# EasyEDA Pro project 快沿发生器.epro

# Schematic Schematic1
Assembly Variant: Basic; Board Name: Board1; Create Date: 2026-08-30; Page Name: P1; Project Name: 快沿发生器; Schematic Name: Schematic1; Update Date: 2026-08-30; Company: 嘉立创EDA; Page Size: A4; Version: V1.0
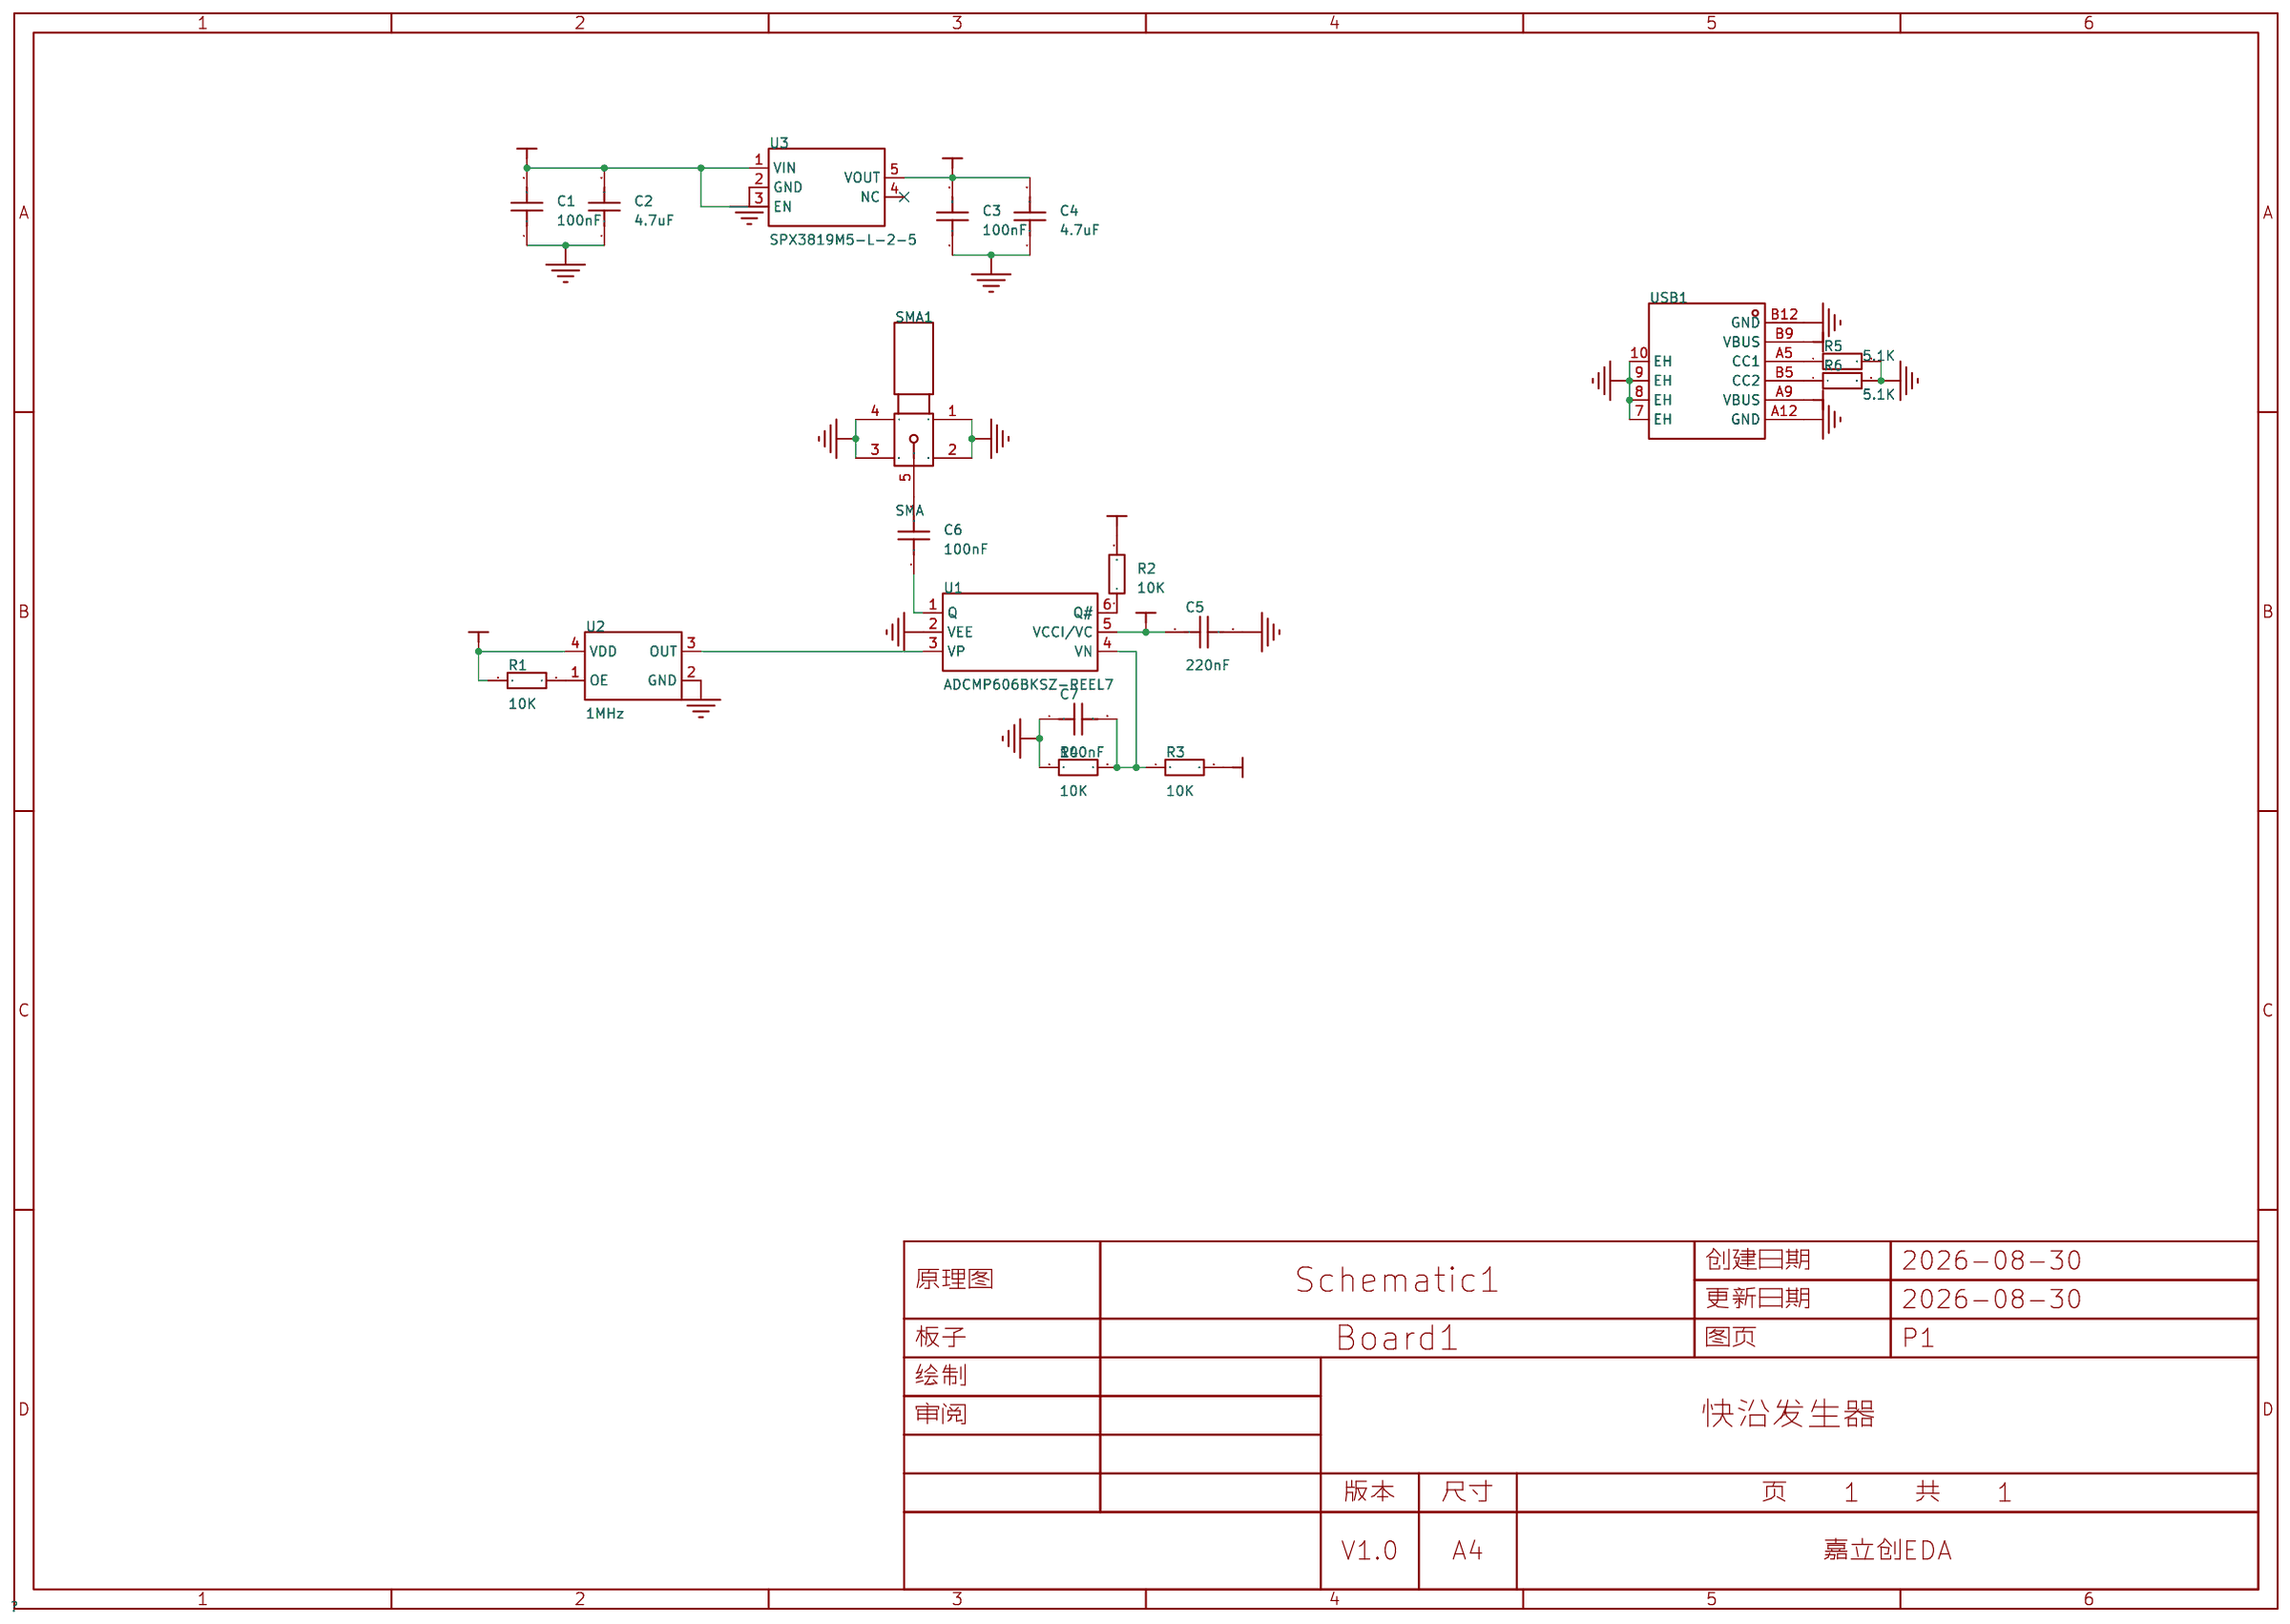
[diagram p0: schematic sheet]

## Parts
C1  100nF  [C0805]
C2  4.7uF  [C0805]
C3  100nF  [C0805]
C4  4.7uF  [C0805]
C5  220nF  [C0603]
C6  100nF  [C0603]
C7  100nF  [C0603]
R1  10K  [R0603]
R2  10K  [R0603]
R3  10K  [R0603]
R4  10K  [R0603]
R5  5.1K  [R0603]
R6  5.1K  [R0603]
SMA1  SMA  [SMA-SMD_BWSMA-KE-P001]
U1  ADCMP606BKSZ-REEL7  [SC-70-6_L2.0-W1.3-P0.65-LS2.1-BR]
U2  1MHz  [OSC-SMD_4P-L3.2-W2.5-BL]
U3  SPX3819M5-L-2-5  [SOT-23-5_L2.9-W1.6-P0.95-LS2.8-BR]
USB1  -  [USB_ TYPE-C-6P]

## Library data of the parts
C1-C4 = CAP_0805: Supplier Footprint: 0805
C5-C7 = CAP_0603: Supplier Footprint: 0603
R1-R6 = Res_0603: Supplier Footprint: 0603
SMA1 = SMA: Supplier Part: C9900018296; JLCPCB Part Class: Extended Part; Supplier: LCSC
U1 = ADCMP606BKSZ-REEL7: 比较器数:单路;输入失调电压(Vos):5mV;输入偏置电流(Ib):2uA;轨到轨:轨到轨输入,轨到轨输出;; LCSC Part Name: 轨到轨、2.5 V至5.5 V、单电源CML极快型比较器，采用6引脚SC70封装; Supplier Part: C654510; Manufacturer: ADI(亚德诺); Supplier Footprint: SC-70-6; JLCPCB Part Class: Extended Part; Datasheet: https://item.szlcsc.com/datasheet/ADCMP606BKSZ-REEL7/684064.html; Supplier: LCSC; Number of Channels: 单路; Vos - Input Offset Voltage: 5mV; Ib - Input Bias Current: 2uA; Propagation Delay Time: 1.25ns; Input Hysteresis Voltage (Vhys): 50mV; Common Mode Rejection Ratio(CMRR): 50dB; Output Mode: CMOS；TTL; Rail to Rail: 轨到轨输入,轨到轨输出; Quiescent Current: 21mA; Operating Temperature: -40℃~+125℃; Single Supply: 2.5V~5.5V; Input Offset Current(Ios): 2000nA
U2 = SX3M1.000M20F30TNN: 频率:1MHz;常温频差:±20ppm;输出模式:CMOS;工作电压:1.62V~3.63V;工作电流:10mA;频率稳定度:±30ppm;; LCSC Part Name: 1MHz ±20ppm 1.62V~3.63V CMOS; Supplier Part: C2901547; Manufacturer: SCTF(星通时频); Supplier Footprint: SMD3225-4P; JLCPCB Part Class: Extended Part; Datasheet: https://item.szlcsc.com/datasheet/SX3M1.000M20F30TNN/3151360.html; Supplier: LCSC; Normal temperature Frequency Tolerance: ±20ppm; Output Type: CMOS; Voltage - Supply: 1.62V~3.63V; Current - Supply: 10mA; Frequency Stability: ±30ppm; Operating Temperature: -40℃~+85℃
U3 = SPX3819M5-L-2-5_C23380893: 输出极性:正极;工作电压:20V;输出电压:2.5V;输出电流:500mA;电源纹波抑制比(PSRR):70dB@(1kHz);输出类型:固定;; LCSC Part Name: 2.5V 500mA 20V; Supplier Part: C23380893; Manufacturer: TECH PUBLIC(台舟); Supplier Footprint: SOT-23-5; JLCPCB Part Class: Extended Part; Datasheet: https://item.szlcsc.com/datasheet/SPX3819M5-L-2-5/25111563.html; Supplier: LCSC; Output Configuration: 正极; Voltage - Supply: 20V; Output Voltage: 2.5V; Output Current: 500mA; Power Supply Rejection Ratio (PSRR): 70dB@(1kHz); Voltage Dropout: 350mV@(100mA); standby current: 5uA; Features: 使能控制；过流保护；热关断; Operating Temperature: -40℃~+125℃@(Tj); Output Type: 固定; Number of Outputs: 1
USB1 = USB_ Type-C-6P: Supplier Footprint: SMD

## Nets
3V3: C3.2 C4.2 C5.1 R1.1 R2.2 R3.2 U1.5(VCCI/VC) U2.4(VDD) U3.5(VOUT)
GND: C1.1 C2.1 C3.1 C4.1 C5.2 C7.1 R4.1 R5.2 R6.2 SMA1.1 SMA1.2 SMA1.3 SMA1.4 U1.2(VEE) U2.2(GND) U3.2(GND) USB1.7(EH) USB1.8(EH) USB1.9(EH) USB1.10(EH) USB1.A12(GND) USB1.B12(GND)
VCC: C1.2 C2.2 U3.1(VIN) U3.3(EN) USB1.A9(VBUS) USB1.B9(VBUS)
$1N8: R1.2 U2.1(OE)
$1N10: R2.1 U1.6(Q#)
$1N15: C6.1 U1.1(Q)
$1N16: C6.2 SMA1.5
$1N19: U1.3(VP) U2.3(OUT)
$1N22: C7.2 R3.1 R4.2 U1.4(VN)
$1N29: R5.1 USB1.A5(CC1)
$1N30: R6.1 USB1.B5(CC2)

Not connected (* = marked no-connect by the designer): U3 4(NC)*

# Board PCB1
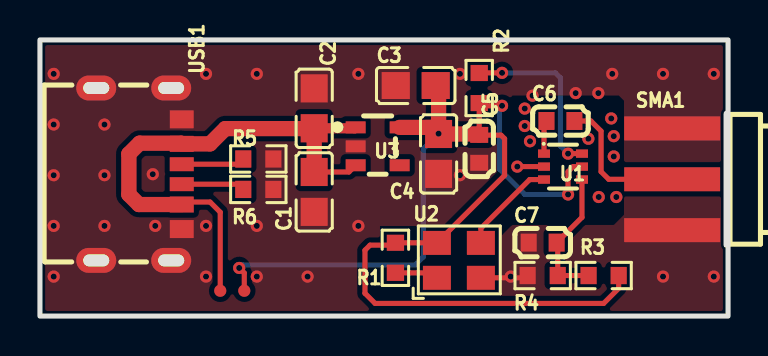
[diagram p1: board, top side]
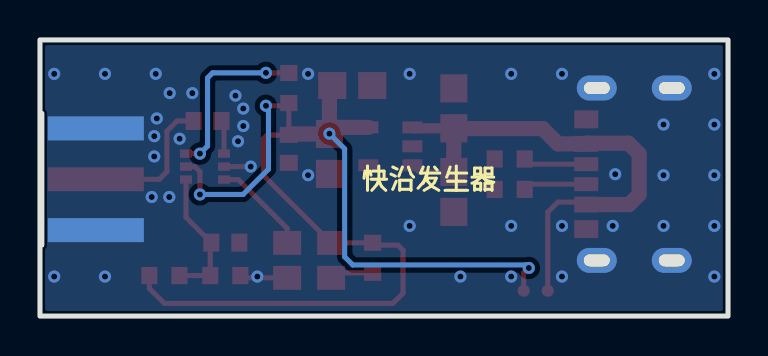
[diagram p2: board, bottom side, seen from below]

Outline 34.42 x 13.84 mm; copper layers: Top Layer, Bottom Layer. Coordinates in mm from the lower left corner of the outline.
Outline path: rectangle 0,13.84 34.42,0
Stack: Top Layer 0.035mm / Dielectric1 1.51mm FR4 er 4.5 / Bottom Layer 0.035mm

## Design rules (mm)
spacing copperThickness1oz (default): track to track 0.102, other pairs 0.152 to 0.3
spacing copperThickness2oz: track to track 0.203, other pairs 0.152 to 0.3
track width copperThickness1oz (default): min 0.127, default 0.254, max 2.54
track width copperThickness2oz: min 0.203, default 0.254, max 2.54
differential pair differentialPair (default): width min 0.127, default 0.254, max 2.54; gap min 0.152, default 0.152
net GND uses copperRegion
net VCC uses copperRegion

## Placement (name value [footprint] x y rotation side)
C1  100nF  [C0805]  13.72 6.22 90 top
C2  4.7uF  [C0805]  13.72 10.41 270 top
C3  100nF  [C0805]  18.8 11.56 0 top
C4  4.7uF  [C0805]  19.94 8.13 90 top
C5  220nF  [C0603]  21.97 8.38 270 top
C6  100nF  [C0603]  26.03 9.78 0 top
C7  100nF  [C0603]  25.15 3.68 0 top
NOREF  -  [Pad_e203]  9.02 1.27 0 top
NOREF#2  -  [Pad_e204]  10.22 1.27 0 top
R1  10K  [R0603]  17.78 2.92 270 top
R2  10K  [R0603]  21.97 11.43 270 top
R3  10K  [R0603]  28.19 2.03 0 top
R4  10K  [R0603]  25.15 2.03 0 top
R5  5.1K  [R0603]  10.92 7.87 0 top
R6  5.1K  [R0603]  10.92 6.35 0 top
SMA1  SMA  [SMA-SMD_BWSMA-KE-P001]  31.62 6.86 0 top
U1  ADCMP606BKSZ-REEL7  [SC-70-6_L2.0-W1.3-P0.65-LS2.1-BR]  26.16 7.49 180 top
U2  1MHz  [OSC-SMD_4P-L3.2-W2.5-BL]  20.96 2.79 0 top
U3  SPX3819M5-L-2-5  [SOT-23-5_L2.9-W1.6-P0.95-LS2.8-BR]  16.89 8.51 180 top
USB1  -  [USB_ TYPE-C-6P]  4.95 7.24 270 top

## Footprints (pads in the part's own frame, mm; a bottom-side part is the same pattern mirrored in y, then rotated)
C0603
  rect 0.8x0.9 smd: 1(-0.7,0) 2(0.7,0)
C0805
  rect 1.41x1.35 smd: 1(-1,0) 2(1,0)
OSC-SMD_4P-L3.2-W2.5-BL
  rect 1.4x1.2 smd: 1(-1.1,-0.875) 2(1.1,-0.875) 3(1.1,0.875) 4(-1.1,0.875)
Pad_e203
  round 0.61 smd: TP1(0,0)
Pad_e204
  round 0.61 smd: TP2(0,0)
R0603
  rect 0.806x0.864 smd: 1(-0.753,0) 2(0.753,0)
SC-70-6_L2.0-W1.3-P0.65-LS2.1-BR
  rect 0.6x0.42 smd: 1(0.95,-0.65) 2(0.95,0) 3(0.95,0.65) 4(-0.95,0.65) 5(-0.95,0) 6(-0.95,-0.65)
SMA-SMD_BWSMA-KE-P001
  rect 4.8x1.2 smd: 1(0,-2.55) 2(0,2.55) 5(0,0)
  rect 4.8x1.2 smd far side: 3(0,2.55) 4(0,-2.55)
SOT-23-5_L2.9-W1.6-P0.95-LS2.8-BR
  rect 1x0.6 smd: 1(1.1,-0.95) 2(1.1,0) 3(1.1,0.95) 4(-1.1,0.95) 5(-1.1,-0.95)
USB_ TYPE-C-6P
  oval 1.25x2 hole 0.6x1.3: 7(-4.193,1.611) 8(4.447,1.611) 9(-4.193,-2.139) 10(4.447,-2.139)
  rect 0.7x1.2 smd: A5(-0.373,2.139) B5(0.627,2.139)
  rect 0.8x1.2 smd: A9(1.647,2.139) B9(-1.393,2.139)
  rect 0.9x1.2 smd: A12(2.877,2.139) B12(-2.623,2.139)

## Nets
As in the schematic, except:
3V3: C3.2 C4.2 C5.1 NOREF#2.TP2 R1.1 R2.2 R3.2 U1.5 U2.4 U3.5
VCC: C1.2 C2.2 NOREF.TP1 U3.1 U3.3 USB1.A9 USB1.B9

Pads without a net: U3 4

## Via types
v1: diameter 0.61, hole 0.305, Top Layer to Bottom Layer, 46 vias

## Routing (per net, layer and track width the routed paths; a pad name or vN(x,y) marks a point on that pad's centre or on a via; arc(x,y) is an arc through that point)
3V3: length 63.5
  Top Layer w0.254: 21.98,9.07 23.06,9.07 23.24,8.89 23.24,7.06 U2.4 19.85,3.67 R1.1 17.66,3.56 16.51,3.56 16.26,3.3 16.26,1.14 16.76,0.64 28.19,0.64 28.95,1.39 R3.2 ; v1(23.11,10.54) 22.11,10.54 R2.2 C5.1 ; U1.5 26.67,7.49 26.42,7.24 v1(26.42,6.1) ; NOREF#2.TP2 10.22,2.16 v1(9.97,2.41)
  Top Layer w0.762: U3.5 19.61,9.46 C4.2 ; C4.2 21.93,9.13 C5.1 ; C4.2 19.94,11.41 C3.2
  Bottom Layer w0.254: v1(19.94,9.14) 19.18,8.38 19.18,2.97 18.77,2.56 10.12,2.56 v1(9.97,2.41) ; v1(23.11,10.54) 22.99,10.41 22.99,7.37 24.26,6.1 v1(26.42,6.1)
GND: length 3.7
  Top Layer w0.254: U2.2 24.28,1.92 R4.1 ; U1.2 v1(23.88,7.49)
  vias: v1(0.69,12.14) v1(0.69,9.6) v1(0.69,7.06) v1(0.69,4.52) v1(0.69,1.98) v1(3.23,9.6) v1(3.23,7.06) v1(3.23,4.52) v1(5.64,7.11) v1(5.77,4.52) v1(8.31,12.14) v1(8.31,4.52) v1(8.31,1.98) v1(10.85,12.14) v1(10.85,4.52) v1(10.85,1.98) v1(13.39,1.98) v1(15.93,12.14) v1(15.93,4.52) v1(21.01,12.14) v1(21.01,7.06) v1(23.55,1.98) v1(24.25,10.4) v1(24.25,9.53) v1(24.51,8.76) v1(24.64,11.05) v1(26.8,11.18) v1(27.43,8.89) v1(27.93,11.18) v1(27.95,5.97) v1(28.63,12.14) v1(28.57,9.91) v1(28.7,9.02) v1(28.7,8) v1(28.83,5.97) v1(31.17,12.14) v1(31.17,1.98) v1(33.71,12.14) v1(33.71,1.98)
VCC: length 27.3
  Top Layer w0.254: C1.2 15.46,7.22 U3.3 ; USB1.A9 7.22,5.72 8.51,5.72 9.02,5.21 NOREF.TP1
  Top Layer w0.508: C2.2 15.75,9.41 U3.1
  Top Layer w0.762: C1.2 C2.2 13.7,9.4 9.27,9.4 8.5,8.63 USB1.B9 7.06,8.67 4.98,8.67 4.44,8.13 4.44,6.1 4.95,5.59 USB1.A9
$1N8: length 2.2
  Top Layer w0.254: R1.2 19.61,2.17 U2.1
$1N10: length 8.8
  Top Layer w0.254: R2.1 21.98,12.19 v1(23.11,12.19) ; U1.6 v1(26.42,8.14)
  Bottom Layer w0.254: v1(23.11,12.19) 25.78,12.19 26.03,11.94 26.03,8.52 v1(26.42,8.14)
$1N15: length 1.7
  Top Layer w0.254: C6.1 25.21,9.66 U1.1
$1N16: length 7.3
  Top Layer w0.254: 26.74,9.78 27.56,9.78 28.07,9.27 28.07,7.24 28.45,6.86 SMA1.5
$1N19: length 4.9
  Top Layer w0.254: U1.3 24.5,6.84 22.06,4.4 U2.3
$1N22: length 6.9
  Top Layer w0.254: R3.1 R4.2 25.9,3.63 C7.2 27.11,4.95 U1.4
$1N29: length 3.2
  Top Layer w0.254: R5.1 9.91,7.61 USB1.A5
$1N30: length 3.2
  Top Layer w0.254: USB1.B5 9.91,6.61 R6.1

## Copper pours and planes (outline as drawn; the poured copper is in the pictures)
GND on Top Layer: 0,13.84 34.42,13.84 34.42,0 0,0
GND on Bottom Layer: 0,13.84 34.42,13.84 34.42,-0.13 0,-0.13

## Text on the board
Bottom Silkscreen Layer: 快沿发生器
